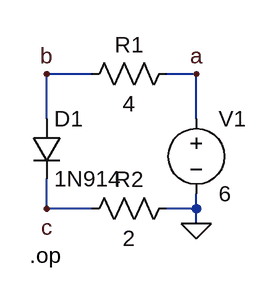
[diagram p0: schematic Draft3.asc]
Draft3.asc, the LTspice schematic file:
Version 4
SHEET 1 880 680
WIRE 160 192 112 192
WIRE 272 192 240 192
WIRE 112 240 112 192
WIRE 272 240 272 192
WIRE 112 336 112 304
WIRE 160 336 112 336
WIRE 272 336 272 320
WIRE 272 336 240 336
WIRE 272 352 272 336
FLAG 272 352 0
FLAG 272 192 a
FLAG 112 192 b
FLAG 112 336 c
SYMBOL diode 96 240 R0
SYMATTR InstName D1
SYMATTR Value 1N914
SYMBOL res 256 176 R90
WINDOW 0 0 56 VBottom 2
WINDOW 3 32 56 VTop 2
SYMATTR InstName R1
SYMATTR Value 4
SYMBOL voltage 272 224 R0
SYMATTR InstName V1
SYMATTR Value 6
SYMBOL res 256 320 R90
WINDOW 0 0 56 VBottom 2
WINDOW 3 32 56 VTop 2
SYMATTR InstName R2
SYMATTR Value 2
TEXT 94 386 Left 2 !.op

The netlist it stands for:
* Draft3.asc
D1 b c 1N914
R1 a b 4
V1 a 0 6
R2 0 c 2
.model D D
.lib standard.dio
.op
.backanno
.end